# Altium schematic sheet 24V_board.SchDoc
size A4
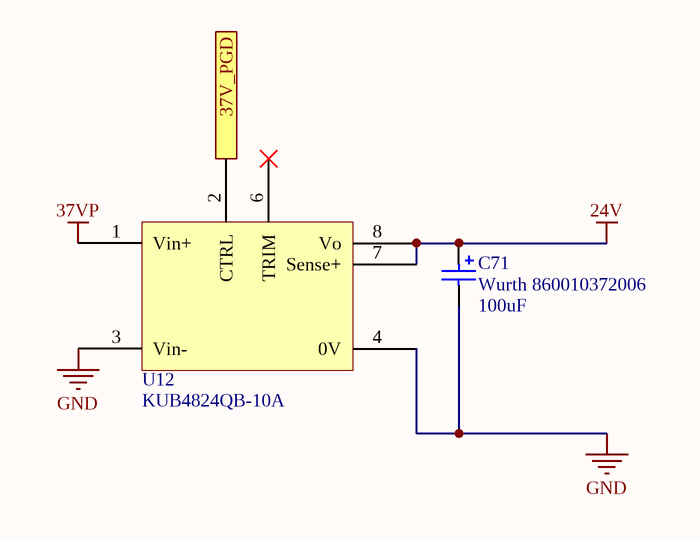
[diagram p0: 24V_board.SchDoc]

## Parts
C71  Wurth 860010372006  value 100uF  [Wurth 860010372006]
U12  KUB4824QB-10A  [KUB48XXQB-10A]

## Ports
37V_PGD (in)

## Nets
24V: C71.1 U12.7(Sense+) U12.8(Vo)
37VP: U12.1(Vin+)
GND: C71.2 U12.3(Vin-) U12.4(0V)
37V_PGD: U12.2(CTRL) ; port 37V_PGD

Not connected (* = marked no-connect by the designer): U12 6(TRIM)*

## Library data of the parts
C71 = Wurth 860010372006: Polarized Capacitor (Radial)
U12 = KUB4812QB-10A: 12V 10A DC DC step down